# Altium schematic sheet TAG.SchDoc: TAG
size A4; CompanyName: STMicroelectronics; Organization: Microcontrollers Division; DocumentNumber: 9; SheetNumber: 15; SheetTotal: 19
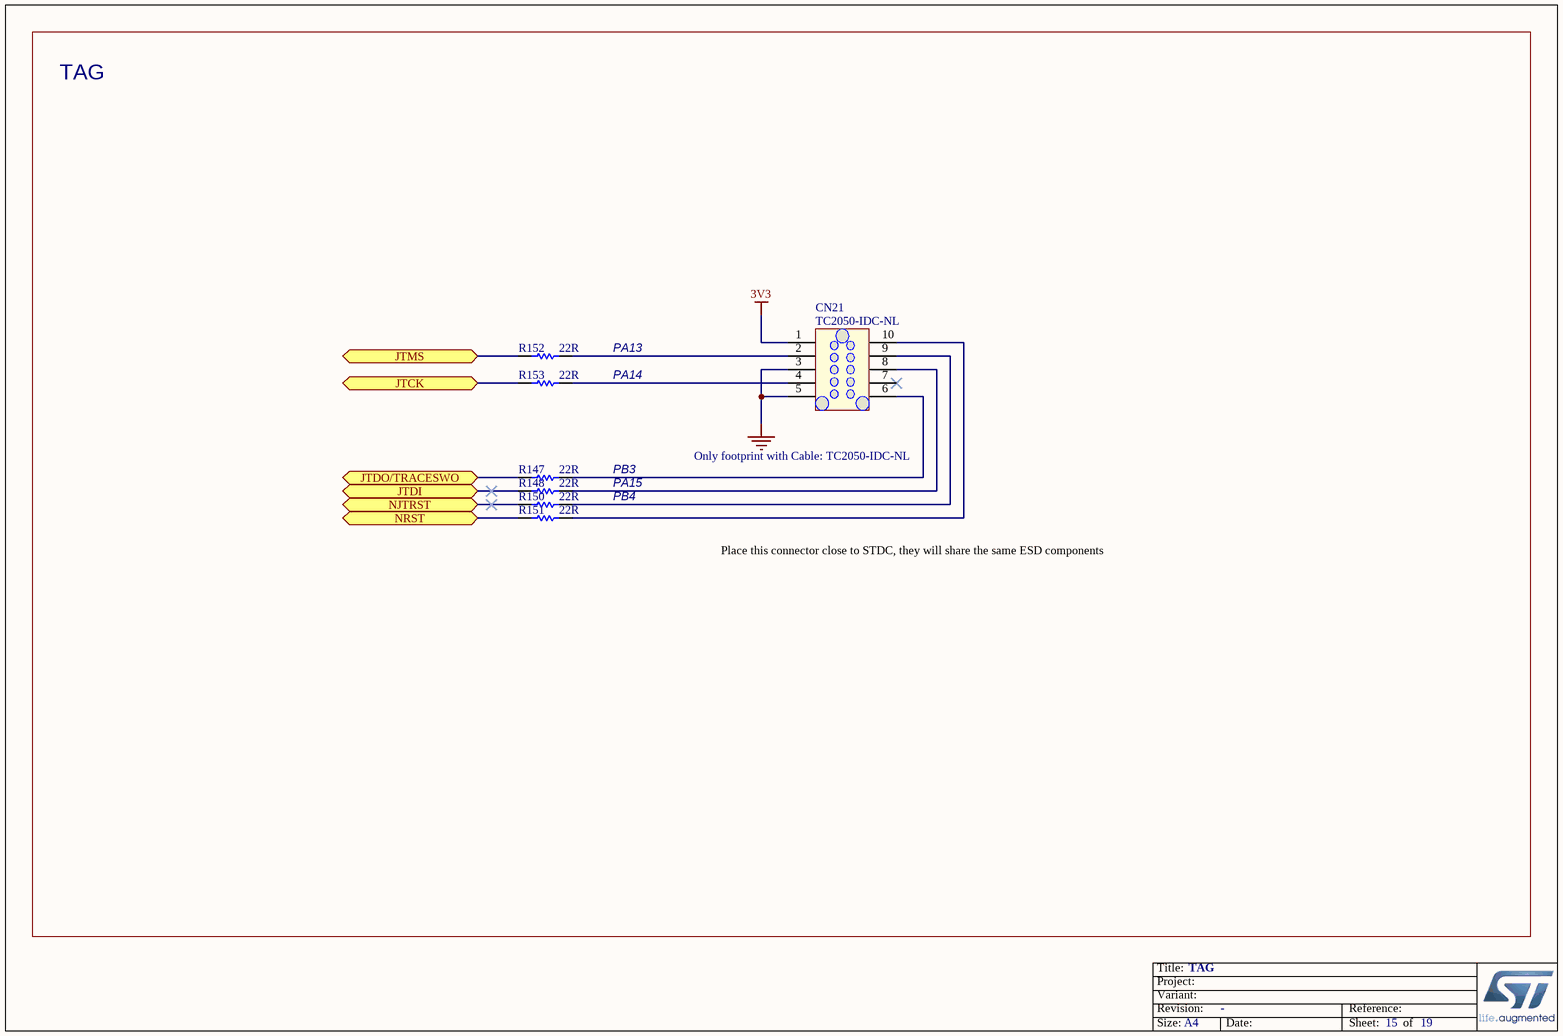
[diagram p0: TAG.SchDoc]

## Parts
CN21  value TC2050-IDC-NL  [CON_TAG-C_TC2050-IDC-NL]  (hidden comment: Tag-10-C)
R147  value 22R  [R0402]  (hidden comment: Resistor)
R148  value 22R  [R0402]  (hidden comment: Resistor)
R150  value 22R  [R0402]  (hidden comment: Resistor)
R151  value 22R  [R0402]  (hidden comment: Resistor)
R152  value 22R  [R0402]  (hidden comment: Resistor)
R153  value 22R  [R0402]  (hidden comment: Resistor)

## Ports
JTCK, JTDI, JTDO/TRACESWO, JTMS, NJTRST, NRST

## Nets
3V3: CN21.1
GND: CN21.3 CN21.5
JTCK: R153.1 ; port JTCK
JTDI: R148.1 ; port JTDI
JTDO/TRACESWO: R147.1 ; port JTDO/TRACESWO
JTMS: R152.1 ; port JTMS
NJTRST: R150.1 ; port NJTRST
NRST: R151.1 ; port NRST
NetCN21_2: CN21.2 R152.2
NetCN21_4: CN21.4 R153.2
NetCN21_6: CN21.6 R147.2
NetCN21_8: CN21.8 R148.2
NetCN21_9: CN21.9 R150.2
NetCN21_10: CN21.10 R151.2

Not connected (* = marked no-connect by the designer): CN21 7*

## Notes on the sheet
- TAG
- PA13
- PA14
- PB3
- PA15
- PB4
- Only footprint with Cable: TC2050-IDC-NL
- Place this connector close to STDC, they will share the same ESD components
- Title:
- Project:
- Size:
- Revision:
- Variant:
- A4
- -
- Date:
- Reference:
- Sheet:
- of

## Library data of the parts
CN21 = MCD-00031: Tag_Connector Header, 10x2, No legs; Manufacturer_Part_Number: TC2050-IDC-NL-FP; Manufacturer: TAG-CONNECT LLC; Provided_By: SUBCO; Internal_Part_Number: MCD-00031; Status: Released; Part_Type: Connector; ComponentLink1Description: Datasheet; ComponentLink1URL: http://tunmcdsvn.tun.st.com/Component_Datasheet_Library/Trunk/Connectors/TAG_Connector_TC2050-IDC-NLFP
R147 R148 R150-R153 = MCD-00189: Resistor,22R,0402,1%,1/16W; Manufacturer_Part_Number: RC0402FR-0722RL; Manufacturer: YAGEO; Provided_By: SUBCO; Internal_Part_Number: MCD-00189; Status: Released; Part_Type: Resistor; Package: R0402; ComponentLink1Description: Datasheet; ComponentLink1URL: http://tunmcdsvn.tun.st.com/Component_Datasheet_Library/Trunk/Resistors/Yageo_Resistor_RC0402-series